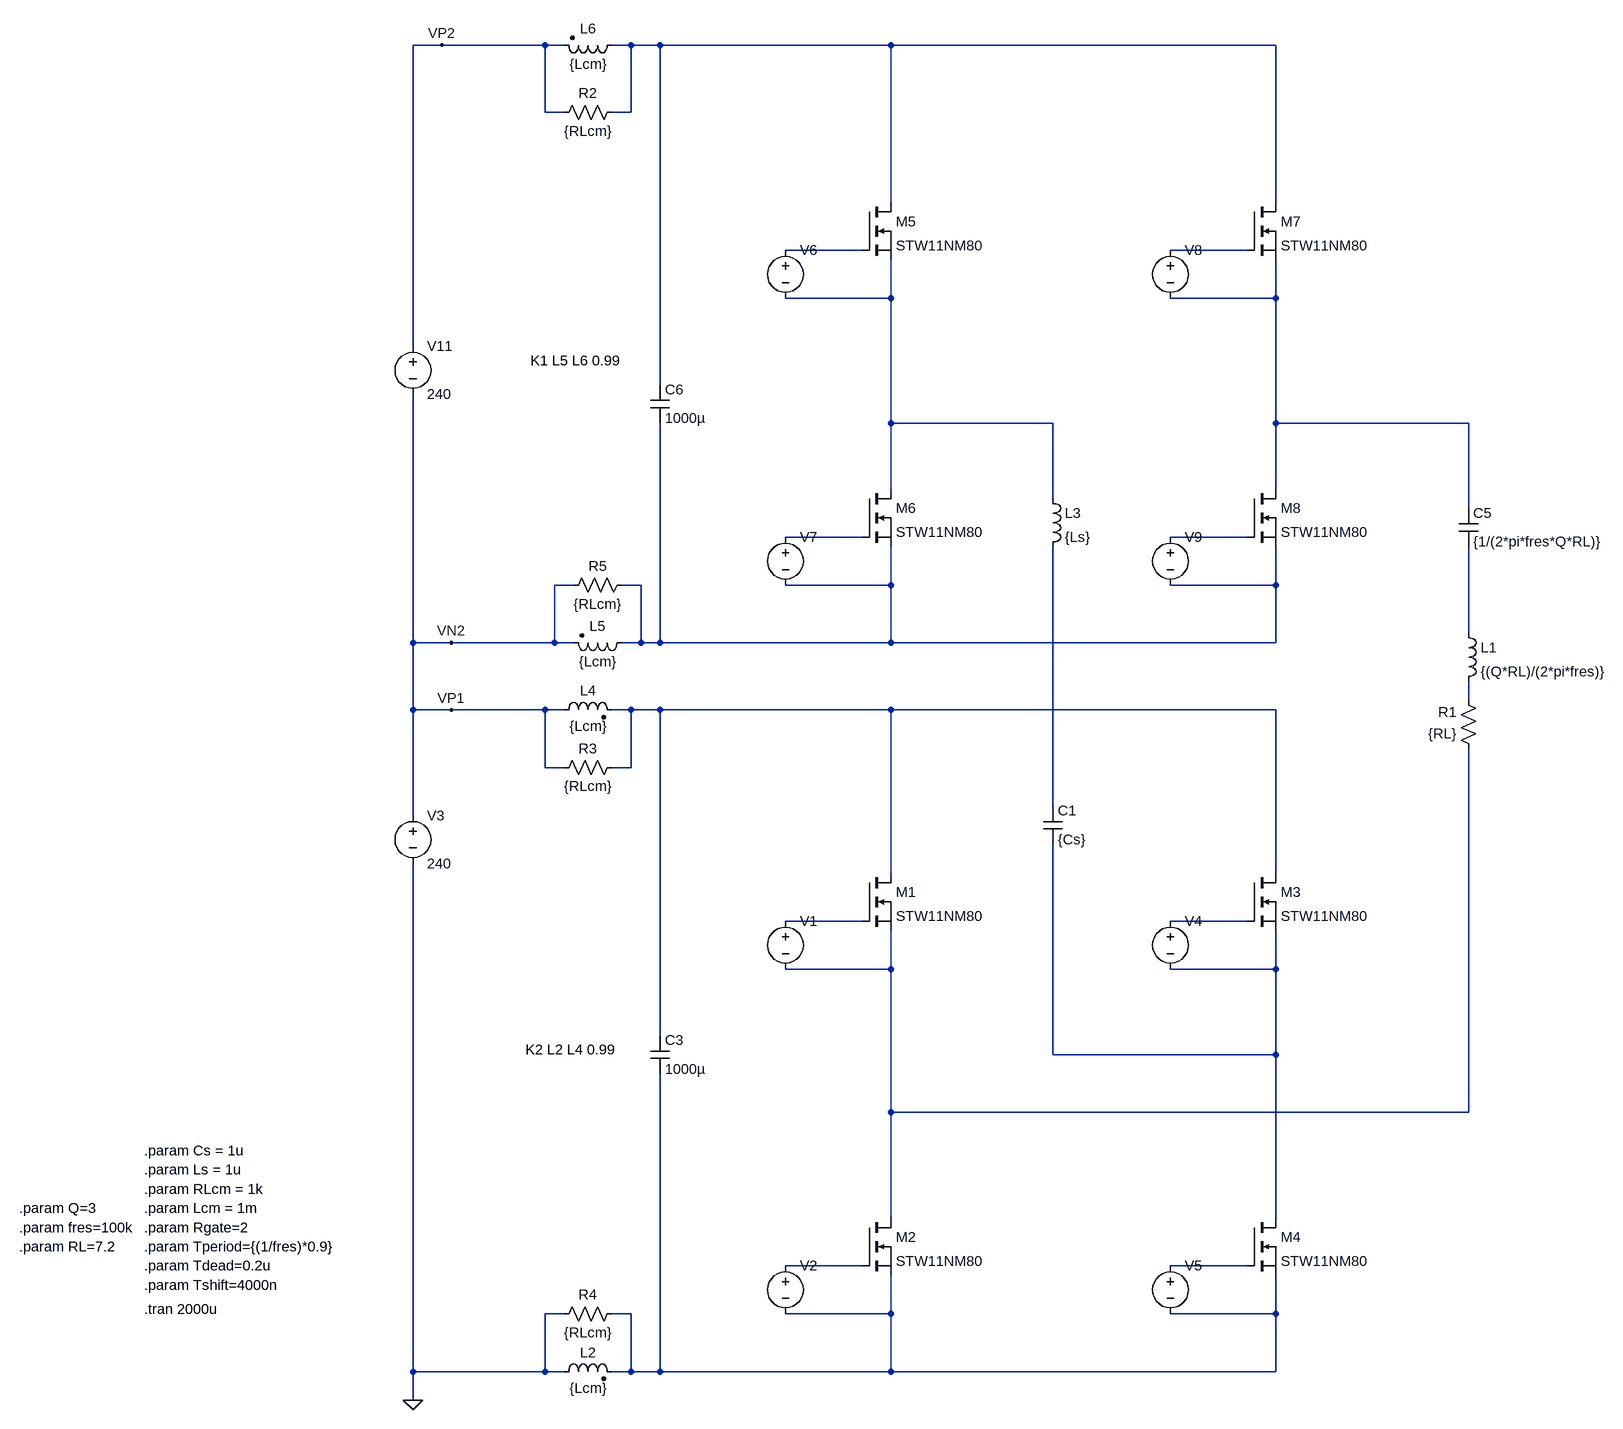
[diagram p0: schematic inv_sim10.asc]
inv_sim10.asc, the LTspice schematic file:
Version 4
SHEET 1 2752 948
WIRE -416 -1568 -464 -1568
WIRE -224 -1568 -416 -1568
WIRE -192 -1568 -224 -1568
WIRE -80 -1568 -112 -1568
WIRE -32 -1568 -80 -1568
WIRE 608 -1568 -32 -1568
WIRE 1680 -1568 608 -1568
WIRE -224 -1456 -224 -1568
WIRE -192 -1456 -224 -1456
WIRE -80 -1456 -80 -1568
WIRE -80 -1456 -112 -1456
WIRE 608 -1296 608 -1568
WIRE 1680 -1296 1680 -1568
WIRE 560 -1216 432 -1216
WIRE 1632 -1216 1504 -1216
WIRE 608 -1136 608 -1200
WIRE 608 -1136 432 -1136
WIRE 1680 -1136 1680 -1200
WIRE 1680 -1136 1504 -1136
WIRE -464 -1056 -464 -1568
WIRE -32 -992 -32 -1568
WIRE 608 -928 608 -1136
WIRE 1088 -928 608 -928
WIRE 1680 -928 1680 -1136
WIRE 2416 -928 1680 -928
WIRE 608 -688 608 -928
WIRE 1680 -688 1680 -928
WIRE 1088 -672 1088 -928
WIRE 2416 -656 2416 -928
WIRE 560 -608 432 -608
WIRE 1632 -608 1504 -608
WIRE -176 -528 -208 -528
WIRE -64 -528 -96 -528
WIRE 608 -528 608 -592
WIRE 608 -528 432 -528
WIRE 1680 -528 1680 -592
WIRE 1680 -528 1504 -528
WIRE 2416 -448 2416 -592
WIRE -464 -432 -464 -976
WIRE -400 -432 -464 -432
WIRE -208 -432 -208 -528
WIRE -208 -432 -400 -432
WIRE -176 -432 -208 -432
WIRE -64 -432 -64 -528
WIRE -64 -432 -96 -432
WIRE -32 -432 -32 -928
WIRE -32 -432 -64 -432
WIRE 608 -432 608 -528
WIRE 608 -432 -32 -432
WIRE 1680 -432 1680 -528
WIRE 1680 -432 608 -432
WIRE 2416 -336 2416 -368
WIRE -464 -320 -464 -432
WIRE -400 -320 -464 -320
WIRE -224 -320 -400 -320
WIRE -192 -320 -224 -320
WIRE -80 -320 -112 -320
WIRE -32 -320 -80 -320
WIRE 608 -320 -32 -320
WIRE 1680 -320 608 -320
WIRE -224 -224 -224 -320
WIRE -192 -224 -224 -224
WIRE -80 -224 -80 -320
WIRE -80 -224 -112 -224
WIRE 1088 -160 1088 -592
WIRE -464 -144 -464 -320
WIRE 608 -48 608 -320
WIRE 1680 -48 1680 -320
WIRE 560 32 432 32
WIRE 1632 32 1504 32
WIRE 608 112 608 48
WIRE 608 112 432 112
WIRE 1680 112 1680 48
WIRE 1680 112 1504 112
WIRE -32 256 -32 -320
WIRE 1088 288 1088 -96
WIRE 1680 288 1680 112
WIRE 1680 288 1088 288
WIRE 608 384 608 112
WIRE 2416 384 2416 -256
WIRE 2416 384 608 384
WIRE 608 560 608 384
WIRE 1680 560 1680 288
WIRE 560 640 432 640
WIRE 1632 640 1504 640
WIRE -192 720 -224 720
WIRE -80 720 -112 720
WIRE 608 720 608 656
WIRE 608 720 432 720
WIRE 1680 720 1680 656
WIRE 1680 720 1504 720
WIRE -464 816 -464 -64
WIRE -224 816 -224 720
WIRE -224 816 -464 816
WIRE -192 816 -224 816
WIRE -80 816 -80 720
WIRE -80 816 -112 816
WIRE -32 816 -32 320
WIRE -32 816 -80 816
WIRE 608 816 608 720
WIRE 608 816 -32 816
WIRE 1680 816 1680 720
WIRE 1680 816 608 816
WIRE -464 864 -464 816
FLAG -464 864 0
FLAG -416 -1568 VP2
FLAG -400 -432 VN2
FLAG -400 -320 VP1
SYMBOL nmos 560 -48 R0
SYMATTR InstName M1
SYMATTR Value STW11NM80
SYMBOL nmos 560 560 R0
SYMATTR InstName M2
SYMATTR Value STW11NM80
SYMBOL voltage 432 16 R0
WINDOW 3 24 96 Invisible 2
WINDOW 123 0 0 Left 2
SYMATTR Value PULSE(0 15 {Tperiod / 4} 50n 50n {Tperiod / 2 - Tdead} {Tperiod})
SYMATTR InstName V1
SYMATTR SpiceLine Rser={Rgate}
SYMBOL voltage -464 -160 R0
WINDOW 123 0 0 Left 2
WINDOW 39 0 0 Left 2
SYMATTR InstName V3
SYMATTR Value 240
SYMBOL voltage 432 624 R0
WINDOW 3 24 96 Invisible 2
WINDOW 123 0 0 Left 2
SYMATTR Value PULSE(0 15 {3 * Tperiod / 4} 50n 50n {Tperiod / 2 - Tdead} {Tperiod})
SYMATTR InstName V2
SYMATTR SpiceLine Rser={Rgate}
SYMBOL ind 2400 -464 R0
SYMATTR InstName L1
SYMATTR Value {(Q*RL)/(2*pi*fres)}
SYMBOL res 2432 -240 R180
WINDOW 0 36 76 Left 2
WINDOW 3 36 40 Left 2
SYMATTR InstName R1
SYMATTR Value {RL}
SYMBOL nmos 1632 -48 R0
SYMATTR InstName M3
SYMATTR Value STW11NM80
SYMBOL nmos 1632 560 R0
SYMATTR InstName M4
SYMATTR Value STW11NM80
SYMBOL voltage 1504 16 R0
WINDOW 3 24 96 Invisible 2
WINDOW 123 0 0 Left 2
SYMATTR Value PULSE(0 15 {3 * Tperiod / 4} 50n 50n {Tperiod / 2 - Tdead} {Tperiod})
SYMATTR InstName V4
SYMATTR SpiceLine Rser={Rgate}
SYMBOL voltage 1504 624 R0
WINDOW 3 24 96 Invisible 2
WINDOW 123 0 0 Left 2
SYMATTR Value PULSE(0 15 {Tperiod / 4} 50n 50n {Tperiod / 2 - Tdead} {Tperiod})
SYMATTR InstName V5
SYMATTR SpiceLine Rser={Rgate}
SYMBOL ind2 -208 832 R270
WINDOW 0 32 56 VTop 2
WINDOW 3 4 56 VBottom 2
SYMATTR InstName L2
SYMATTR Value {Lcm}
SYMATTR Type ind
SYMBOL ind2 -208 -304 R270
WINDOW 0 32 56 VTop 2
WINDOW 3 4 56 VBottom 2
SYMATTR InstName L4
SYMATTR Value {Lcm}
SYMATTR Type ind
SYMBOL cap -48 256 R0
SYMATTR InstName C3
SYMATTR Value 1000µ
SYMBOL nmos 560 -1296 R0
SYMATTR InstName M5
SYMATTR Value STW11NM80
SYMBOL nmos 560 -688 R0
SYMATTR InstName M6
SYMATTR Value STW11NM80
SYMBOL voltage 432 -1232 R0
WINDOW 3 24 96 Invisible 2
WINDOW 123 0 0 Left 2
SYMATTR Value PULSE(0 15 {Tperiod / 4 + Tshift} 50n 50n {Tperiod / 2 - Tdead} {Tperiod})
SYMATTR InstName V6
SYMATTR SpiceLine Rser={Rgate}
SYMBOL voltage 432 -624 R0
WINDOW 3 24 96 Invisible 2
WINDOW 123 0 0 Left 2
SYMATTR Value PULSE(0 15 {3 * Tperiod / 4 + Tshift} 50n 50n {Tperiod / 2 - Tdead} {Tperiod})
SYMATTR InstName V7
SYMATTR SpiceLine Rser={Rgate}
SYMBOL nmos 1632 -1296 R0
SYMATTR InstName M7
SYMATTR Value STW11NM80
SYMBOL nmos 1632 -688 R0
SYMATTR InstName M8
SYMATTR Value STW11NM80
SYMBOL voltage 1504 -1232 R0
WINDOW 3 24 96 Invisible 2
WINDOW 123 0 0 Left 2
SYMATTR Value PULSE(0 15 {3 * Tperiod / 4 + Tshift} 50n 50n {Tperiod / 2 - Tdead} {Tperiod})
SYMATTR InstName V8
SYMATTR SpiceLine Rser={Rgate}
SYMBOL voltage 1504 -624 R0
WINDOW 3 24 96 Invisible 2
WINDOW 123 0 0 Left 2
SYMATTR Value PULSE(0 15 {Tperiod / 4 + Tshift} 50n 50n {Tperiod / 2 - Tdead} {Tperiod})
SYMATTR InstName V9
SYMATTR SpiceLine Rser={Rgate}
SYMBOL ind2 -80 -448 R90
WINDOW 3 32 56 VTop 2
WINDOW 0 4 56 VBottom 2
SYMATTR Value {Lcm}
SYMATTR InstName L5
SYMATTR Type ind
SYMBOL ind2 -96 -1584 R90
WINDOW 0 4 56 VBottom 2
WINDOW 3 32 56 VTop 2
SYMATTR InstName L6
SYMATTR Value {Lcm}
SYMATTR Type ind
SYMBOL cap 2400 -656 R0
SYMATTR InstName C5
SYMATTR Value {1/(2*pi*fres*Q*RL)}
SYMBOL cap -48 -992 R0
SYMATTR InstName C6
SYMATTR Value 1000µ
SYMBOL res -208 -1440 R270
WINDOW 0 32 56 VTop 2
WINDOW 3 0 56 VBottom 2
SYMATTR InstName R2
SYMATTR Value {RLcm}
SYMBOL res -96 -240 R90
WINDOW 0 0 56 VBottom 2
WINDOW 3 32 56 VTop 2
SYMATTR InstName R3
SYMATTR Value {RLcm}
SYMBOL res -96 704 R90
WINDOW 0 0 56 VBottom 2
WINDOW 3 32 56 VTop 2
SYMATTR InstName R4
SYMATTR Value {RLcm}
SYMBOL res -192 -512 R270
WINDOW 0 32 56 VTop 2
WINDOW 3 0 56 VBottom 2
SYMATTR InstName R5
SYMATTR Value {RLcm}
SYMBOL voltage -464 -1072 R0
WINDOW 123 0 0 Left 2
WINDOW 39 0 0 Left 2
SYMATTR InstName V11
SYMATTR Value 240
SYMBOL ind 1072 -688 R0
SYMATTR InstName L3
SYMATTR Value {Ls}
SYMBOL cap 1072 -160 R0
SYMATTR InstName C1
SYMATTR Value {Cs}
TEXT -1064 576 Left 2 !.param Rgate=2
TEXT -1064 712 Left 2 !.tran 2000u
TEXT -1064 608 Left 2 !.param Tperiod={(1/fres)*0.9}
TEXT -1064 640 Left 2 !.param Tdead=0.2u
TEXT -1272 544 Left 2 !.param Q=3
TEXT -1272 576 Left 2 !.param fres=100k
TEXT -1272 608 Left 2 !.param RL=7.2
TEXT -1064 672 Left 2 !.param Tshift=4000n
TEXT -1064 544 Left 2 !.param Lcm = 1m
TEXT -1064 512 Left 2 !.param RLcm = 1k
TEXT -248 -1032 Left 2 !K1 L5 L6 0.99
TEXT -256 280 Left 2 !K2 L2 L4 0.99
TEXT -1064 480 Left 2 !.param Ls = 1u
TEXT -1064 448 Left 2 !.param Cs = 1u

The netlist it stands for:
* inv_sim10.asc
M1 N011 N013 N015 N015 STW11NM80
M2 N015 N017 N019 N019 STW11NM80
V1 N013 N015 PULSE(0 15 {Tperiod / 4} 50n 50n {Tperiod / 2 - Tdead} {Tperiod}) Rser={Rgate}
V3 VP1 0 240
V2 N017 N019 PULSE(0 15 {3 * Tperiod / 4} 50n 50n {Tperiod / 2 - Tdead} {Tperiod}) Rser={Rgate}
L1 N009 N010 {(Q*RL)/(2*pi*fres)}
R1 N015 N010 {RL}
M3 N011 N014 N016 N016 STW11NM80
M4 N016 N018 N019 N019 STW11NM80
V4 N014 N016 PULSE(0 15 {3 * Tperiod / 4} 50n 50n {Tperiod / 2 - Tdead} {Tperiod}) Rser={Rgate}
V5 N018 N019 PULSE(0 15 {Tperiod / 4} 50n 50n {Tperiod / 2 - Tdead} {Tperiod}) Rser={Rgate}
L2 0 N019 {Lcm}
L4 VP1 N011 {Lcm}
C3 N011 N019 1000µ
M5 N001 N002 N004 N004 STW11NM80
M6 N004 N006 N008 N008 STW11NM80
V6 N002 N004 PULSE(0 15 {Tperiod / 4 + Tshift} 50n 50n {Tperiod / 2 - Tdead} {Tperiod}) Rser={Rgate}
V7 N006 N008 PULSE(0 15 {3 * Tperiod / 4 + Tshift} 50n 50n {Tperiod / 2 - Tdead} {Tperiod}) Rser={Rgate}
M7 N001 N003 N005 N005 STW11NM80
M8 N005 N007 N008 N008 STW11NM80
V8 N003 N005 PULSE(0 15 {3 * Tperiod / 4 + Tshift} 50n 50n {Tperiod / 2 - Tdead} {Tperiod}) Rser={Rgate}
V9 N007 N008 PULSE(0 15 {Tperiod / 4 + Tshift} 50n 50n {Tperiod / 2 - Tdead} {Tperiod}) Rser={Rgate}
L5 N008 VP1 {Lcm}
L6 N001 VP2 {Lcm}
C5 N005 N009 {1/(2*pi*fres*Q*RL)}
C6 N001 N008 1000µ
R2 VP2 N001 {RLcm}
R3 N011 VP1 {RLcm}
R4 N019 0 {RLcm}
R5 VP1 N008 {RLcm}
V11 VP2 VP1 240
L3 N004 N012 {Ls}
C1 N012 N016 {Cs}
.model NMOS NMOS
.model PMOS PMOS
.lib standard.mos
.param Rgate=2
.tran 2000u
.param Tperiod={(1/fres)*0.9}
.param Tdead=0.2u
.param Q=3
.param fres=100k
.param RL=7.2
.param Tshift=4000n
.param Lcm = 1m
.param RLcm = 1k
K1 L5 L6 0.99
K2 L2 L4 0.99
.param Ls = 1u
.param Cs = 1u
.backanno
.end